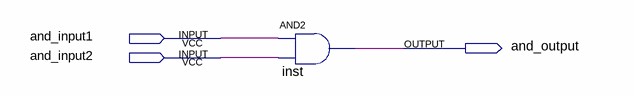
[diagram p0: schematic sheet]
// Quartus schematic 20240525_quartus_test_and_gate.bdf as structural Verilog: 1 symbols, 3 pins
module \20240525_quartus_test_and_gate  (
  input  and_input1,
  input  and_input2,
  output and_output
);

  and inst (and_output, and_input1, and_input2);
endmodule
